# EasyEDA schematic aeroponics_schematic.json
TITLE: PeaPod Aeroponic Circuit; REV: 0.1; Date: 2021-05-25; Sheet: 1/1; Drawn By: Jayden Lefebvre; Company: UTAG
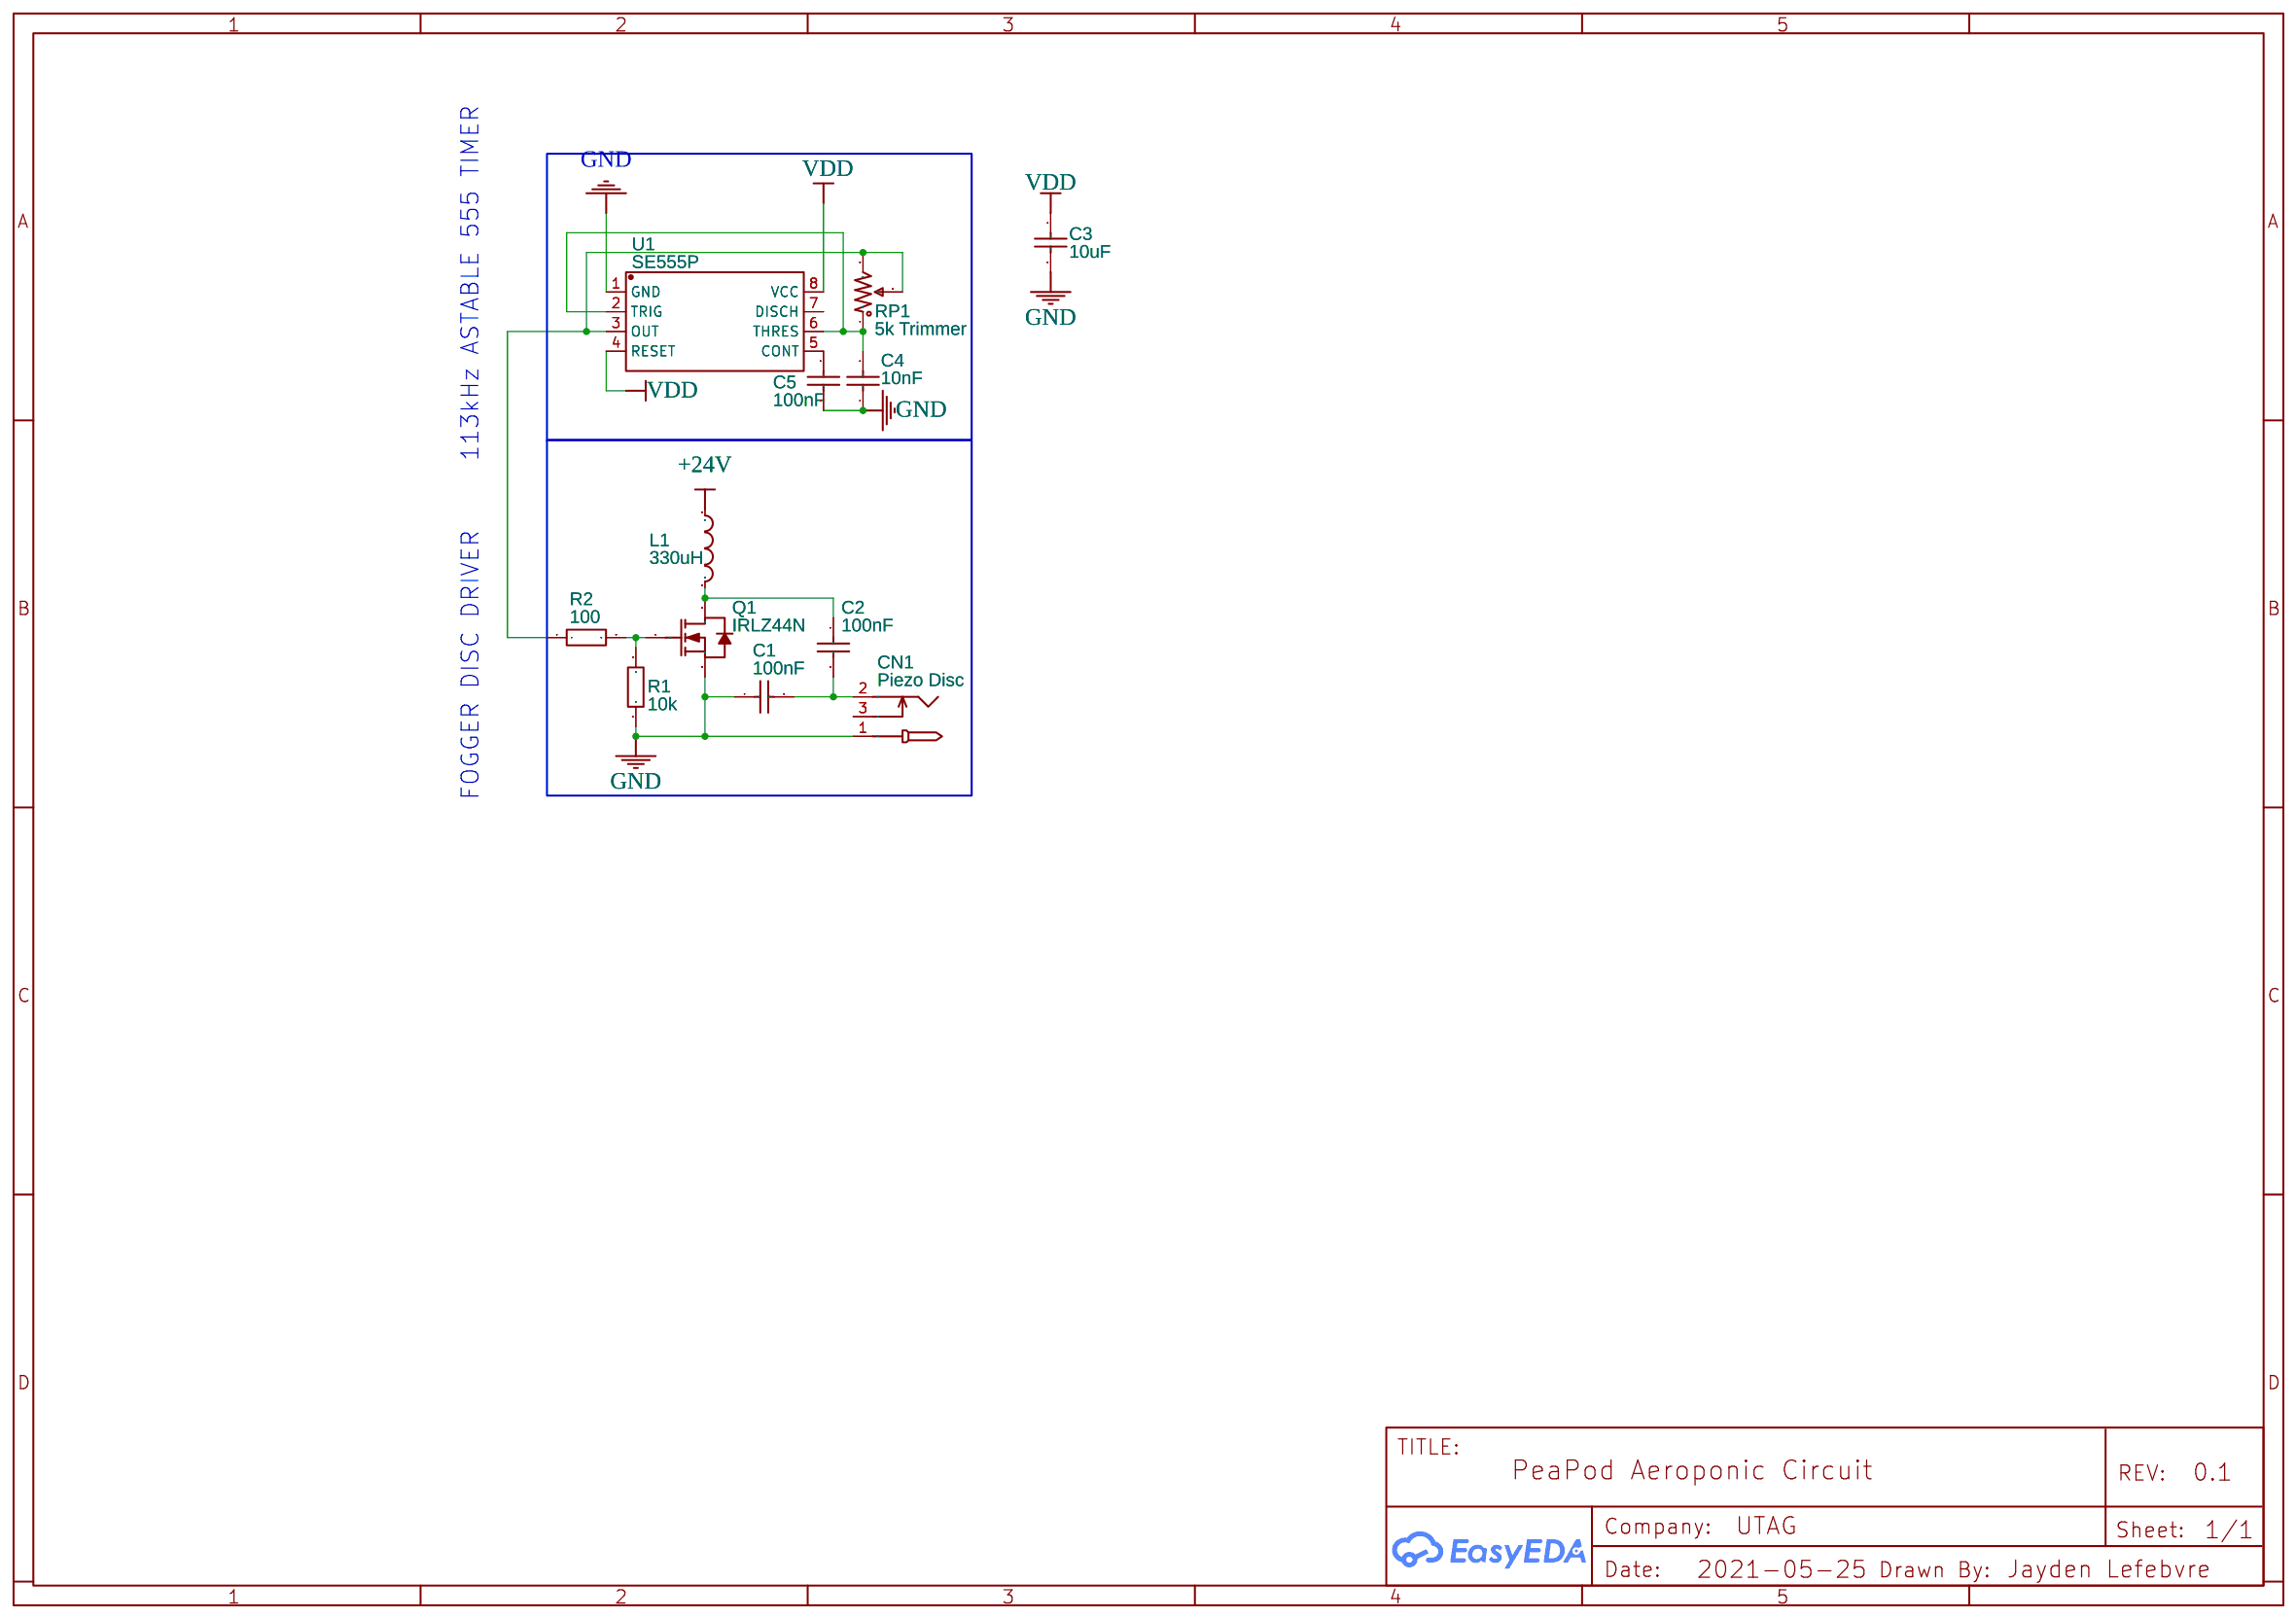
[diagram p0: schematic sheet]

## Parts
C1  100nF  [C0402]
C2  100nF  [C0402]
C3  10uF  [C0402]
C4  10nF  [C0402]
C5  100nF  [C0402]
CN1  Piezo Disc  [DC-5020]
L1  330uH  [L0402]
Q1  IRLZ44N  [TO-220-3_L10.0-W4.5-P2.54-T]
R1  10k  [R0402]
R2  100  [R0402]
RP1  5k Trimmer  [RES-ADJ-TH_3386P]
U1  SE555P  [SOIC-8_L5.0-W4.0-P1.27-LS6.0-BL]

## Library data of the parts
C1-C5 = CL05A106MQ5NUNC: Supplier: LCSC; Manufacturer: SAMSUNG; LCSC Assembly: Yes; Supplier Part: C15525; SMT Type: Basic
CN1 = DC005-2.0MM: Supplier: LCSC; Manufacturer: SOFNG; Supplier Part: C111567
L1 = L0402_US: Contributor: LCEDA_Lib
Q1 = IRLZ44NPBF: Supplier: LCSC; Manufacturer: IR; Supplier Part: C38774
R1 R2 = 0402WGF4751TCE: Supplier: LCSC; Manufacturer: UniOhm; Supplier Part: C25901; LCSC Assembly: Yes; SMT Type: Extend
RP1 = R_3386P_US: Supplier: LCSC; Contributor: LCEDA_Lib; value(Ω): 10K
U1 = NE555D: Supplier: LCSC; Supplier Part: C234230; Manufacturer: Texas Instruments; Contributor: LCSC; LCSC Assembly: Yes; SMT Type: Extend

## Nets
+24V: L1.1
GND: C1.1 C3.2 C4.1 C5.1 CN1.1 Q1.3(S) R1.1 U1.1(GND)
VDD: C3.1 U1.4(RESET) U1.8(VCC)
Net-(C1-2): C1.2 C2.2 CN1.2
Net-(C2-1): C2.1 L1.2 Q1.2(D)
Net-(C4-2): C4.2 RP1.1 U1.2(TRIG) U1.6(THRES)
Net-(C5-2): C5.2 U1.5(CONT)
Net-(Q1-1): Q1.1(G) R1.2 R2.2
Net-(R2-1): R2.1 RP1.2 RP1.3 U1.3(OUT)

Not connected (* = marked no-connect by the designer): CN1 3; U1 7(DISCH)

## Notes on the sheet
- 113kHz ASTABLE 555 TIMER
- FOGGER DISC DRIVER
